# EAGLE schematic AmplifierStage (EAGLE 7.6.0)
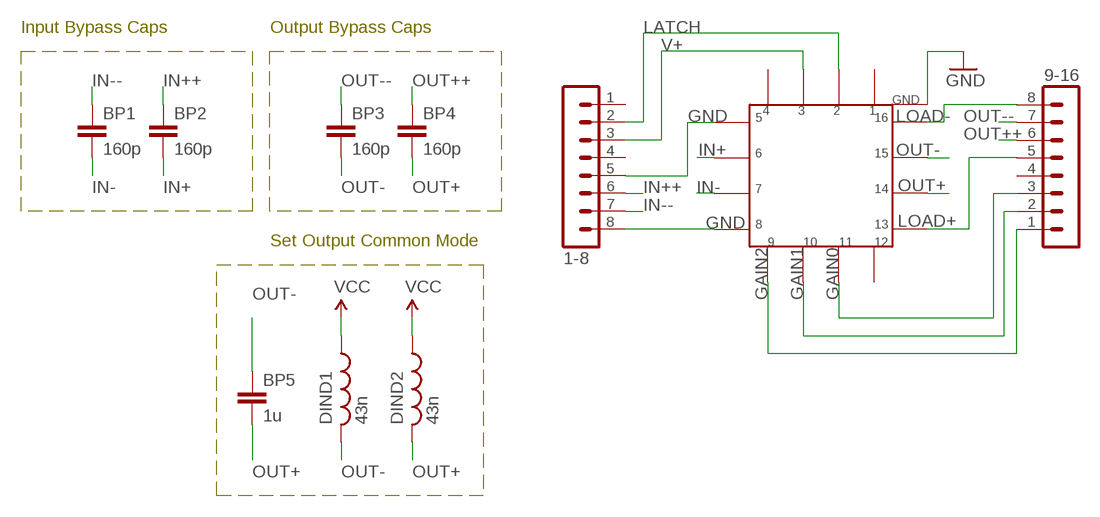
[diagram p0: schematic, sheet 1]

## Parts
1-8  MA08-1  [MA08-1]
9-16  MA08-1  [MA08-1]
BP1  160p  CAP0603-CAP  [0603-CAP]
BP2  160p  CAP0603-CAP  [0603-CAP]
BP3  160p  CAP0603-CAP  [0603-CAP]
BP4  160p  CAP0603-CAP  [0603-CAP]
BP5  1u  CAP0603-CAP  [0603-CAP]
DIND1  43n  L-0402  [0402-RES]
DIND2  43n  L-0402  [0402-RES]
U$1  LMH6514  [WQFN4X4]

## Nets
GAIN0: 9-16.3 U$1.P$11
GAIN1: 9-16.2 U$1.P$10
GAIN2: 9-16.1 U$1.P$9
GND: 1-8.5 1-8.8 U$1.GND U$1.P$5 U$1.P$8
IN+: BP2.2 U$1.P$6
IN++: 1-8.6 BP2.1
IN-: BP1.2 U$1.P$7
IN--: 1-8.7 BP1.1
LATCH: 1-8.2 U$1.P$2
LOAD+: 9-16.5 U$1.P$13
LOAD-: 9-16.8 U$1.P$16
OUT+: BP4.2 BP5.2 DIND2.2 U$1.P$14
OUT++: 9-16.6 BP4.1
OUT-: BP3.2 BP5.1 DIND1.2 U$1.P$15
OUT--: 9-16.7 BP3.1
V+: 1-8.3 DIND1.1 DIND2.1 U$1.P$3 ; supply symbol labelled VCC
Unconnected: 1-8.1 1-8.4 9-16.4 U$1.P$1 U$1.P$4 U$1.P$12

## Notes on the sheet
- Input Bypass Caps | Output Bypass Caps
- Set Output Common Mode

## Library data of the parts
1-8 9-16 = con-lstb:MA08-1: PIN HEADER; OC_FARNELL: unknown; OC_NEWARK: unknown
BP1-BP5 = SparkFun-Capacitors:CAP: Capacitor Standard 0603 ceramic capacitor, and 0.1" leaded capacitor.
DIND1 DIND2 = SONAR:L-0402
U$1 = SONAR:LMH6514: Differential VGA Purpose: ARVP SONAR system for 2017 RoboSub competition lmh6514 <http://www.ti.com/lit/ds/symlink/lmh6514.pdf> to be used for prototype v1. Created by Mike Bardwell (10/2016) Adjustable Gain with a 42 dB Range Precise 6.02 dB Gain Steps Parallel 3 Bit Gain Control On Chip Register Gain Setting Fully Differential Signal Path Single Ended to Differential Capable 200Ω Input Impedance Small Footprint (4 mm x 4 mm) WQFN Package